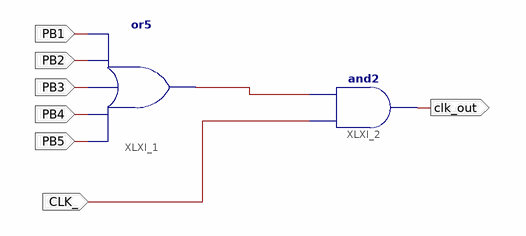
[diagram p0: schematic sheet 1]
// Xilinx ISE schematic commandCounter.sch (spartan6) as structural Verilog: 2 symbols, 7 ports
module commandCounter (
  input  CLK_,
  input  PB5,
  input  PB4,
  input  PB3,
  input  PB2,
  input  PB1,
  output clk_out
);

  wire XLXN_1;

  or XLXI_1 (XLXN_1, PB5, PB4, PB3, PB2, PB1);
  and XLXI_2 (clk_out, CLK_, XLXN_1);
endmodule
